# Altium schematic sheet LC_Filter.SchDoc: Hrafn
size Tabloid; DrawnBy: Nicholas Belsten; Organization: MIT; Address1: Route 40; Address2: Westford MA 01886; Address3: USA; DocumentNumber: 6; SheetNumber: 7; SheetTotal: 10; DCN: 1; ProgramName: AERO-VISTA; ENG_APP_DATE: --/--/--; DSN_APP_DATE: --/--/--; CHK_APP_DATE: --/--/--; Section: LC Filter
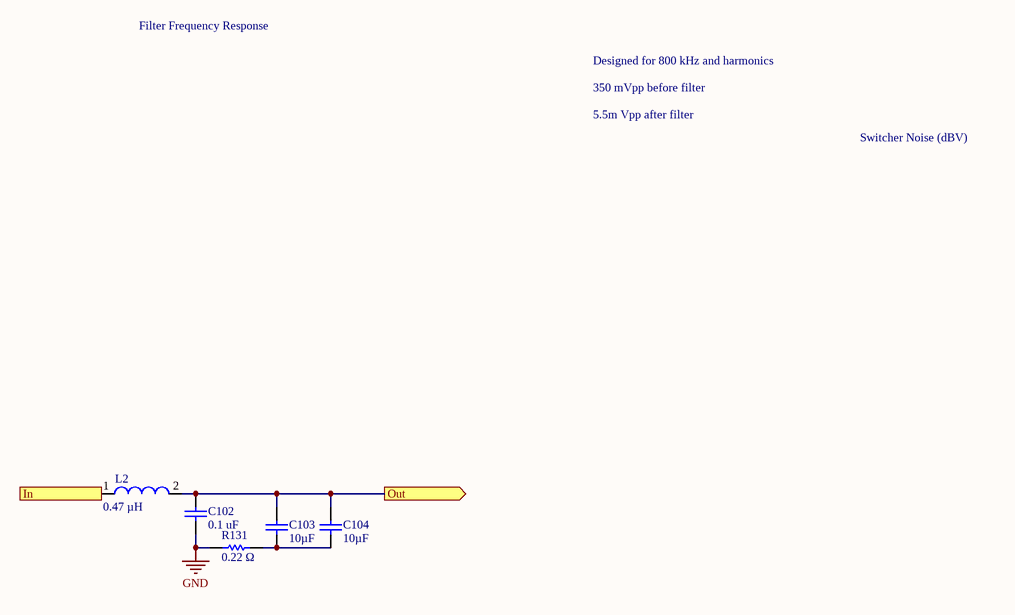
[diagram p0: LC_Filter.SchDoc]

## Parts
C102  0.1 uF  [CAPC0402(1005)60_L]
C103  Capacitance: 10µF  [CAPC1608X100X35LL20T25]  (hidden comment: EMK107BBJ106MA-T)
C104  Capacitance: 10µF  [CAPC1608X100X35LL20T25]  (hidden comment: EMK107BBJ106MA-T)
L2  Inductance: 0.47 µH  [WE-TPC-4828-MH]  (hidden comment: 74404300047)
R131  0.22 Ω  [RESC1608X55X30NL15T15]

## Ports
In (in), Out (out)

## Nets
GND: C102.1 R131.1
In: L2.1 ; port In
Out: C102.2 C103.2 C104.2 L2.2 ; port Out
NetC103_1: C103.1 C104.1 R131.2

## Notes on the sheet
- Filter Frequency Response
- Designed for 800 kHz and harmonics
- 350 mVpp before filter
- 5.5m Vpp after filter
- Switcher Noise (dBV)
- Title
- Size
- Date
- Tabloid
- Section
- Time
- Sheet
- of
- Revision
- Drawn
- 33-207 / 77 Mass. Ave.
- Cambridge, MA 02139
- File

## Library data of the parts
C102 = CMP-1034-02068-1: CAP 100nF 16V ±5% 0402 (1005 Metric) Thickness 0.6mm SMD; Tolerance: Â±5%; Case-EIA: 0402; Case-Metric: 1005; Technology: SMT; Value: 100nF; Max Thickness: 0.6 mm; Rated Voltage: 16 V
C103 C104 = CMP-2000-06226-1: Chip Capacitor, 10 uF, +/- 20%, 16 V, -55 to 85 degC, 0603 (1608 Metric), RoHS, Tape and Reel; Manufacturer: Taiyo Yuden; Voltage - Rated: 16V; Temperature Coefficient: X5R; Other Names: 587-3238-6; Online Catalog: MSeries; Features: -; Thickness (Max): 0.031"(0.80mm); Package / Case: 0603(1608Metric); Datasheet URL: http://www.yuden.co.jp/ut/product/category/capacitor/EMK107BBJ106MA-T.pdf; Category: Capacitors; Lead Style: -; Family: CeramicCapacitors; Package Description: 2-Pin Surface Mount Device, Body 1.70 x 0.90 mm; Tolerance: ±20%; Manufacturer URL: http://www.t-yuden.com/; Operating Temperature: -55°C~85°C; Lead Spacing: -; Height - Seated (Max): -; Series: M; Applications: GeneralPurpose; Size / Dimension: 0.063"Lx0.031"W(1.60mmx0.80mm); Standard Package: 1; Packaging: Digi-Reel®; Mounting Technology: SurfaceMount; Package Reference: 0603; Ratings: -; Datasheet Version: 10/2016; Mounting Type: SurfaceMount,MLCC
L2 = CMP-0227-00320-1: SMD Shielded Tiny Power Inductor WE-TPC, L = 0.47 µH; ComponentLink2Description: Datasheet; DatasheetVersion: ver 6, Aug-2010; PackageDescription: SMD Inductor, 2-Leads, Body 4.8 x 4.8 mm; PackageReference: WE-TPC-4828-MH; ComponentLink2URL: http://www.we-online.de/katalog/media/pdf/74404300047.pdf; ComponentLink1Description: Manufacturer Link; ComponentLink1URL: http://www.we-online.com; PackageVersion: 2010
R131 = CMP-2000-00853-1: Part Number: ERJ-3RQFR22V; Manufacturer: Panasonic; Resistance: 0.22 Ω